# Altium schematic sheet KAI_MEZON.SchDoc
size A4
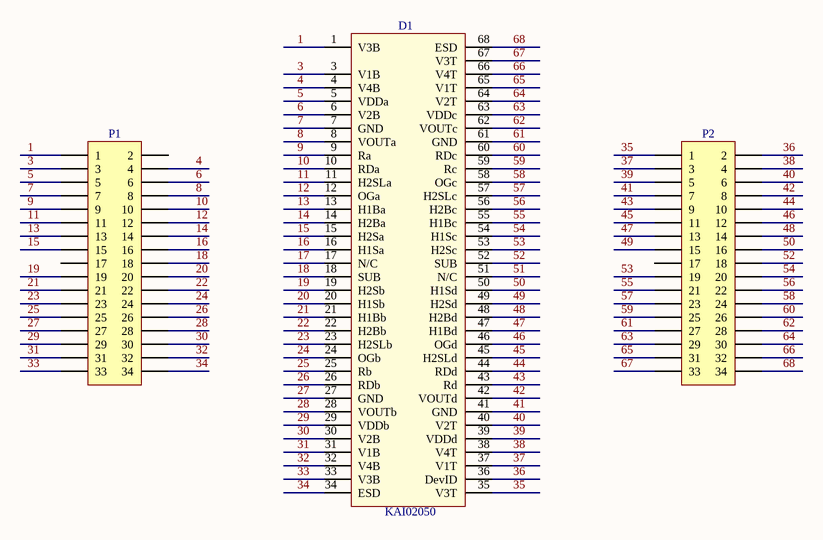
[diagram p0: KAI_MEZON.SchDoc]

## Parts
D1  KAI02050  [KAI_02050]
P1  Header 17X2  [HDR2X17]  (value not drawn)
P2  Header 17X2  [HDR2X17]  (value not drawn)

## Nets
1: D1.1(V3B) P1.1
3: D1.3(V1B) P1.3
4: D1.4(V4B) P1.4
5: D1.5(VDDa) P1.5
6: D1.6(V2B) P1.6
7: D1.7(GND) P1.7
8: D1.8(VOUTa) P1.8
9: D1.9(Ra) P1.9
10: D1.10(RDa) P1.10
11: D1.11(H2SLa) P1.11
12: D1.12(OGa) P1.12
13: D1.13(H1Ba) P1.13
14: D1.14(H2Ba) P1.14
15: D1.15(H2Sa) P1.15
16: D1.16(H1Sa) P1.16
17: D1.17(N/C)
18: D1.18(SUB) P1.18
19: D1.19(H2Sb) P1.19
20: D1.20(H1Sb) P1.20
21: D1.21(H1Bb) P1.21
22: D1.22(H2Bb) P1.22
23: D1.23(H2SLb) P1.23
24: D1.24(OGb) P1.24
25: D1.25(Rb) P1.25
26: D1.26(RDb) P1.26
27: D1.27(GND) P1.27
28: D1.28(VOUTb) P1.28
29: D1.29(VDDb) P1.29
30: D1.30(V2B) P1.30
31: D1.31(V1B) P1.31
32: D1.32(V4B) P1.32
33: D1.33(V3B) P1.33
34: D1.34(ESD) P1.34
35: D1.35(V3T) P2.1
36: D1.36(DevID) P2.2
37: D1.37(V1T) P2.3
38: D1.38(V4T) P2.4
39: D1.39(VDDd) P2.5
40: D1.40(V2T) P2.6
41: D1.41(GND) P2.7
42: D1.42(VOUTd) P2.8
43: D1.43(Rd) P2.9
44: D1.44(RDd) P2.10
45: D1.45(H2SLd) P2.11
46: D1.46(OGd) P2.12
47: D1.47(H1Bd) P2.13
48: D1.48(H2Bd) P2.14
49: D1.49(H2Sd) P2.15
50: D1.50(H1Sd) P2.16
51: D1.51(N/C)
52: D1.52(SUB) P2.18
53: D1.53(H2Sc) P2.19
54: D1.54(H1Sc) P2.20
55: D1.55(H1Bc) P2.21
56: D1.56(H2Bc) P2.22
57: D1.57(H2SLc) P2.23
58: D1.58(OGc) P2.24
59: D1.59(Rc) P2.25
60: D1.60(RDc) P2.26
61: D1.61(GND) P2.27
62: D1.62(VOUTc) P2.28
63: D1.63(VDDc) P2.29
64: D1.64(V2T) P2.30
65: D1.65(V1T) P2.31
66: D1.66(V4T) P2.32
67: D1.67(V3T) P2.33
68: D1.68(ESD) P2.34

Not connected (* = marked no-connect by the designer): P1 2 17; P2 17

## Library data of the parts
D1 = KAI-02050
P1 P2 = Header 17X2: Header, 17-Pin, Dual row; LatestRevisionDate: 17-Jul-2002; LatestRevisionNote: Re-released for DXP Platform.; Publisher: Altium Limited